# Altium schematic sheet Sheet_TX.SchDoc
size A3
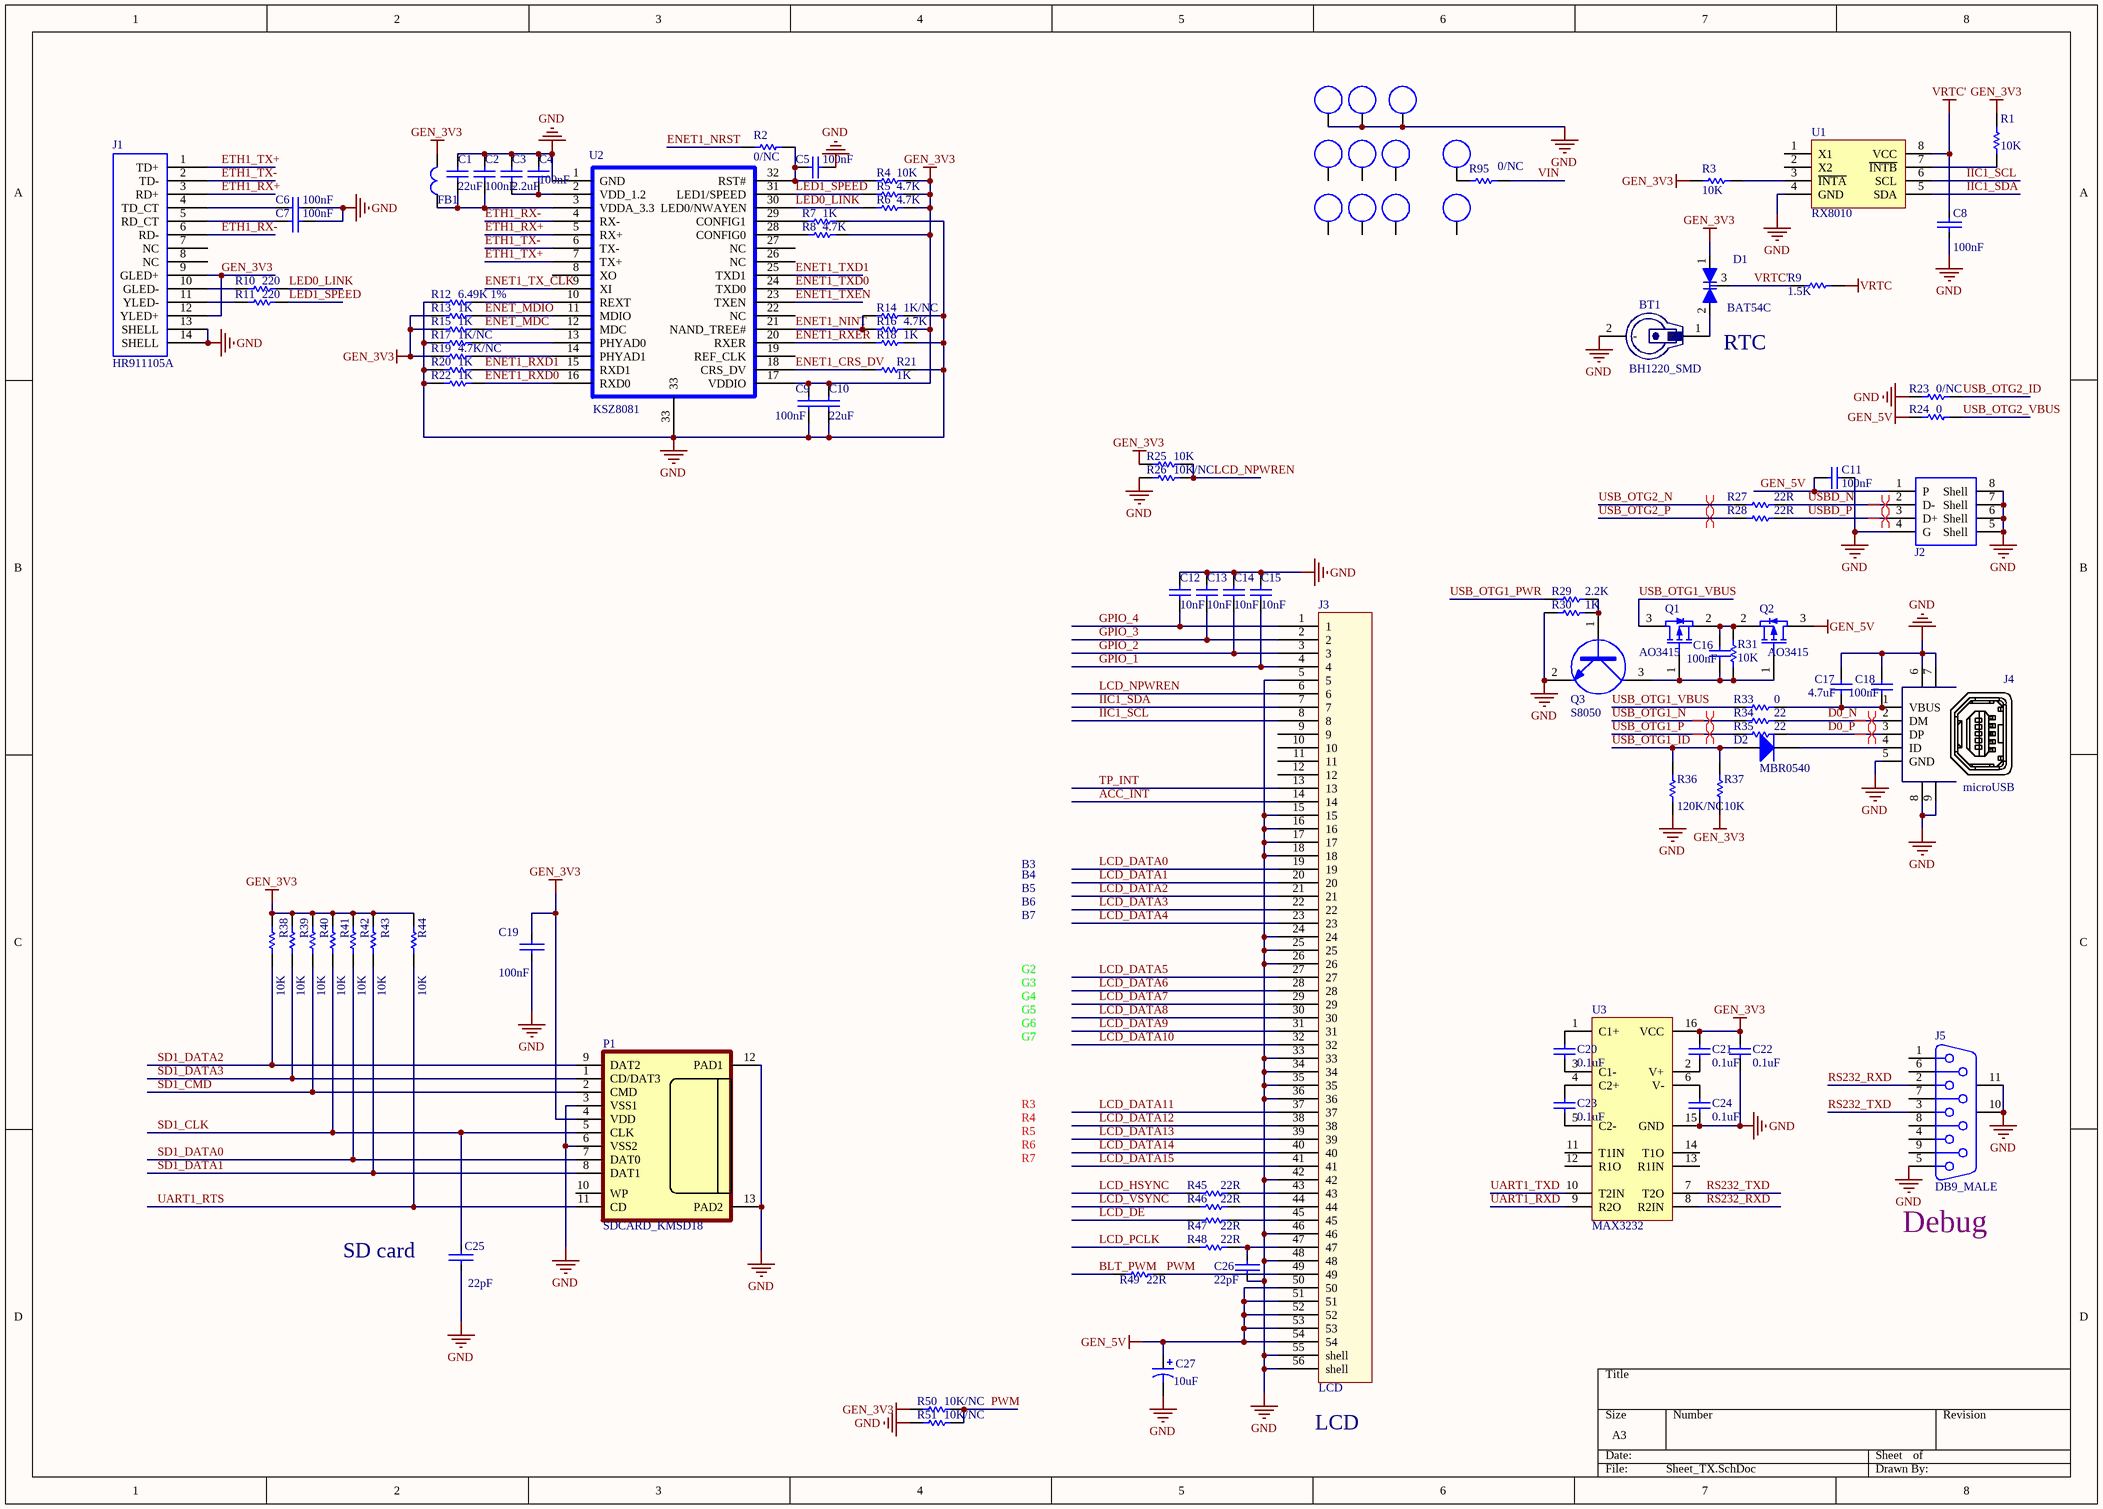
[diagram p0: Sheet_TX.SchDoc]

## Parts
BT1  BH1220_SMD  [B1220]
C1  value 22uF  [0603]  (hidden comment: Cap)
C2  value 100nF  [0603]  (hidden comment: Cap)
C3  value 2.2uF  [0603]  (hidden comment: Cap)
C4  value 100nF  [0603]  (hidden comment: Cap)
C5  value 100nF  [0603]  (hidden comment: Cap)
C6  value 100nF  [0603]  (hidden comment: Cap)
C7  value 100nF  [0603]  (hidden comment: Cap)
C8  100nF  [0603]
C9  value 100nF  [0603]  (hidden comment: Cap)
C10  value 22uF  [0603]  (hidden comment: Cap)
C11  value 100nF  [0603]  (hidden comment: C0603)
C12  value 10nF  [0603]  (hidden comment: C0603)
C13  value 10nF  [0603]  (hidden comment: C0603)
C14  value 10nF  [0603]  (hidden comment: C0603)
C15  value 10nF  [0603]  (hidden comment: C0603)
C16  value 100nF  [0603]  (hidden comment: C0603)
C17  value 4.7uF  [0603]  (hidden comment: C0603)
C18  value 100nF  [0603]  (hidden comment: C0603)
C19  100nF  [0603]
C20  value 0.1uF  [0603]  (hidden comment: C0603)
C21  value 0.1uF  [0603]  (hidden comment: C0603)
C22  value 0.1uF  [0603]  (hidden comment: C0603)
C23  value 0.1uF  [0603]  (hidden comment: C0603)
C24  value 0.1uF  [0603]  (hidden comment: C0603)
C25  22pF  [0603]
C26  22pF  [0603]
C27  value 10uF  [3216A]  (hidden comment: Cap Pol1)
D1  BAT54C  [SOT23]
D2  MBR0540  [SOD-123]
FB1  CZ  [0603]  (value not drawn)
H1  hole  [HOLE]  (value not drawn)
H2  hole  [HOLE]  (value not drawn)
H3  hole  [HOLE]  (value not drawn)
H4  hole  [HOLE]  (value not drawn)
H7  hole  [FLQRS]  (value not drawn)
J1  HR911105A  [RJ-45A12]
J2  USB-A-F-W  [USB-C]  (value not drawn)
J3  LCD  [FPC54_A]
J4  microUSB  [MICRO_USB]
J5  DB9_MALE  [DB9R/M]
M1  hole  [mark]  (value not drawn)
M2  hole  [mark]  (value not drawn)
M3  hole  [mark]  (value not drawn)
M4  hole  [mark]  (value not drawn)
M5  hole  [mark]  (value not drawn)
M6  hole  [mark]  (value not drawn)
P1  SDCARD_KMSD18  [SD-CARD3]
Q1  AO3415  [SOT23]
Q2  AO3415  [SOT23]
Q3  S8050  [SOT23]
R1  10K  [0603]
R2  value 0/NC  [0603]  (hidden comment: Res1)
R3  10K  [0603]
R4  value 10K  [0603]  (hidden comment: Res1)
R5  value 4.7K  [0603]  (hidden comment: Res1)
R6  value 4.7K  [0603]  (hidden comment: Res1)
R7  value 1K  [0603]  (hidden comment: Res1)
R8  value 4.7K  [0603]  (hidden comment: Res1)
R9  value 1.5K  [0603]  (hidden comment: 2.2K)
R10  value 220  [0603]  (hidden comment: Res1)
R11  value 220  [0603]  (hidden comment: Res1)
R12  value 6.49K 1%  [0603]  (hidden comment: Res1)
R13  value 1K  [0603]  (hidden comment: Res1)
R14  value 1K/NC  [0603]  (hidden comment: Res1)
R15  value 1K  [0603]  (hidden comment: Res1)
R16  value 4.7K  [0603]  (hidden comment: Res1)
R17  value 1K/NC  [0603]  (hidden comment: Res1)
R18  value 1K  [0603]  (hidden comment: Res1)
R19  value 4.7K/NC  [0603]  (hidden comment: Res1)
R20  value 1K  [0603]  (hidden comment: Res1)
R21  value 1K  [0603]  (hidden comment: Res1)
R22  value 1K  [0603]  (hidden comment: Res1)
R23  value 0/NC  [0603]  (hidden comment: Res1)
R24  value 0  [0603]  (hidden comment: Res1)
R25  10K  [0603]
R26  value 10K/NC  [0603]  (hidden comment: 10K)
R27  value 22R  [0603]  (hidden comment: 0R)
R28  value 22R  [0603]  (hidden comment: 0R)
R29  value 2.2K  [0603]  (hidden comment: Res1)
R30  value 1K  [0603]  (hidden comment: Res1)
R31  value 10K  [0603]  (hidden comment: Res1)
R33  value 0  [0603]  (hidden comment: Res1)
R34  value 22  [0603]  (hidden comment: 22R)
R35  value 22  [0603]  (hidden comment: 22R)
R36  value 120K/NC  [0603]  (hidden comment: 120K)
R37  10K  [0603]
R38  10K  [0603]
R39  10K  [0603]
R40  10K  [0603]
R41  10K  [0603]
R42  10K  [0603]
R43  10K  [0603]
R44  10K  [0603]
R45  22R  [0603]
R46  22R  [0603]
R47  22R  [0603]
R48  22R  [0603]
R49  22R  [0603]
R50  value 10K/NC  [0603]  (hidden comment: 10K)
R51  value 10K/NC  [0603]  (hidden comment: 10K)
R95  value 0/NC  [0805]  (hidden comment: 10K)
U1  RX8010  [SOIC-8N]
U2  KSZ8081  [QFN-32]
U3  MAX3232  [SO-16]

## Nets
GEN_3V3: C9.1 C10.1 C19.1 C21.1 C22.1 D1.1 FB1.2 J1.9(GLED+) J1.12(YLED+) P1.4(VDD) R1.1 R3.1 R4.1 R5.1 R6.1 R8.1 R13.2 R15.2 R16.1 R19.2 R25.1 R37.1 R38.1 R39.1 R40.1 R41.1 R42.1 R43.1 R44.1 R50.1 U2.17(VDDIO) U3.16(VCC)
GEN_5V: C11.2 C27.1 J2.1(P) J3.50 J3.51 J3.52 J3.53 J3.54 Q2.3(D) R24.1
GND: BT1.2(-) C1.1 C2.1 C3.1 C4.1 C5.1 C6.1 C7.1 C8.2 C9.2 C10.2 C11.1 C12.1 C13.1 C14.1 C15.1 C17.1 C18.1 C19.2 C22.2 C24.2 C25.2 C26.2 C27.2 H1.1 H2.1 H4.1 J1.13(SHELL) J1.14(SHELL) J2.4(G) J2.5(Shell) J2.6(Shell) J2.7(Shell) J2.8(Shell) J3.5 J3.15 J3.16 J3.17 J3.18 J3.24 J3.25 J3.26 J3.33 J3.34 J3.35 J3.36 J3.42 J3.46 J3.48 J3.55(shell) J3.56(shell) J4.5(GND) J4.6 J4.7 J4.8 J4.9 J5.5 J5.10(MH1) J5.11(MH2) P1.3(VSS1) P1.6(VSS2) P1.12(PAD1) P1.13(PAD2) Q3.2(E) R7.1 R12.2 R14.1 R17.2 R18.1 R20.2 R21.1 R22.2 R23.1 R26.1 R30.2 R36.1 R51.1 U1.4(GND) U2.1(GND) U2.33 U3.15(GND)
VRTC: R9.1
VRTC': C8.1 D1.3 R9.2 U1.8(VCC)
ACC_INT: J3.14
BLT_PWM: R49.1
D0_N: J4.2(DM) R34.2
D0_P: J4.3(DP) R35.2
ENET1_CRS_DV: R21.2 U2.18(CRS_DV)
ENET1_NINT: R14.2 R16.2 U2.21(NAND_TREE#)
ENET1_NRST: R2.1
ENET1_RXD0: R22.1 U2.16(RXD0)
ENET1_RXD1: R20.1 U2.15(RXD1)
ENET1_RXER: R18.2 U2.20(RXER)
ENET1_TX_CLK: U2.9(XI)
ENET1_TXD0: U2.24(TXD0)
ENET1_TXD1: U2.25(TXD1)
ENET1_TXEN: U2.23(TXEN)
ENET_MDC: R15.1 U2.12(MDC)
ENET_MDIO: R13.1 U2.11(MDIO)
ETH1_RX+: J1.3(RD+) U2.5(RX+)
ETH1_RX-: J1.6(RD-) U2.4(RX-)
ETH1_TX+: J1.1(TD+) U2.7(TX+)
ETH1_TX-: J1.2(TD-) U2.6(TX-)
GPIO_1: C15.2 J3.4
GPIO_2: C14.2 J3.3
GPIO_3: C13.2 J3.2
GPIO_4: C12.2 J3.1
IIC1_SCL: J3.8 U1.6(SCL)
IIC1_SDA: J3.7 U1.5(SDA)
LCD_DATA0: J3.19
LCD_DATA1: J3.20
LCD_DATA2: J3.21
LCD_DATA3: J3.22
LCD_DATA4: J3.23
LCD_DATA5: J3.27
LCD_DATA6: J3.28
LCD_DATA7: J3.29
LCD_DATA8: J3.30
LCD_DATA9: J3.31
LCD_DATA10: J3.32
LCD_DATA11: J3.37
LCD_DATA12: J3.38
LCD_DATA13: J3.39
LCD_DATA14: J3.40
LCD_DATA15: J3.41
LCD_DE: R47.1
LCD_HSYNC: R45.1
LCD_NPWREN: J3.6 R25.2 R26.2
LCD_PCLK: R48.1
LCD_VSYNC: R46.1
LED0_LINK: R6.2 R10.1 U2.30(LED0/NWAYEN)
LED1_SPEED: R5.2 R11.1 U2.31(LED1/SPEED)
PWM: J3.49 R49.2 R50.2 R51.2
RS232_RXD: J5.2 U3.8(R2IN)
RS232_TXD: J5.3 U3.7(T2O)
SD1_CLK: C25.1 P1.5(CLK) R41.2
SD1_CMD: P1.2(CMD) R40.2
SD1_DATA0: P1.7(DAT0) R42.2
SD1_DATA1: P1.8(DAT1) R43.2
SD1_DATA2: P1.9(DAT2) R38.2
SD1_DATA3: P1.1(CD/DAT3) R39.2
TP_INT: J3.13
UART1_RTS: P1.11(CD) R44.2
UART1_RXD: U3.9(R2O)
UART1_TXD: U3.10(T2IN)
USB_OTG1_ID: D2.1(A) R36.2 R37.2
USB_OTG1_N: R34.1
USB_OTG1_P: R35.1
USB_OTG1_PWR: R29.2
USB_OTG1_VBUS: Q1.3(D) R33.1
USB_OTG2_ID: R23.2
USB_OTG2_N: R27.1
USB_OTG2_P: R28.1
USB_OTG2_VBUS: R24.2
USBD_N: J2.2(D-) R27.2
USBD_P: J2.3(D+) R28.2
VIN: R95.2
NetBT1_1: BT1.1(+) D1.2
NetC1_2: C1.2 C2.2 FB1.1 U2.3(VDDA_3.3)
NetC3_2: C3.2 C4.2 U2.2(VDD_1.2)
NetC5_2: C5.2 R2.2 R4.2 U2.32(RST#)
NetC6_2: C6.2 J1.4(TD_CT)
NetC7_2: C7.2 J1.5(RD_CT)
NetC16_1: C16.1 Q1.2(S) Q2.2(S) R31.2
NetC16_2: C16.2 Q1.1(G) Q2.1(G) Q3.3(C) R31.1
NetC17_2: C17.2 C18.2 J4.1(VBUS) R33.2
NetC20_1: C20.1 U3.1(C1+)
NetC20_2: C20.2 U3.3(C1-)
NetC21_2: C21.2 U3.2(V+)
NetC23_1: C23.1 U3.4(C2+)
NetC23_2: C23.2 U3.5(C2-)
NetC24_1: C24.1 U3.6(V-)
NetC26_1: C26.1 J3.47 R48.2
NetD2_2: D2.2(K) J4.4(ID)
NetH3_1: H3.1 R95.1
NetJ1_10: J1.10(GLED-) R10.2
NetJ1_11: J1.11(YLED-) R11.2
NetJ3_43: J3.43 R45.2
NetJ3_44: J3.44 R46.2
NetJ3_45: J3.45 R47.2
NetQ3_1: Q3.1(B) R29.1 R30.1
NetR1_2: R1.2 U1.7(~{INTB})
NetR3_2: R3.2 U1.3(~{INTA})
NetR7_2: R7.2 U2.29(CONFIG1)
NetR8_2: R8.2 U2.28(CONFIG0)
NetR12_1: R12.1 U2.10(REXT)
NetR17_1: R17.1 U2.13(PHYAD0)
NetR19_1: R19.1 U2.14(PHYAD1)

Not connected (* = marked no-connect by the designer): H7 1; J1 7(NC) 8(NC); J3 9 10 11 12; J5 1 4 6 7 8 9; M1 1; M2 1; M3 1; M4 1; M5 1; M6 1; P1 10(WP); U1 1(X1) 2(X2); U2 8(XO) 19(REF_CLK) 22(NC) 26(NC) 27(NC); U3 11(T1IN) 12(R1O) 13(R1IN) 14(T1O)

## Layout directives
differential pair: D0_N, D0_P, USB_OTG1_N, USB_OTG1_P, USB_OTG2_N, USB_OTG2_P, USBD_N, USBD_P

## Notes on the sheet
- RTC
- B3
- B4
- B5
- B7
- B6
- G2
- G3
- G4
- G5
- G7
- G6
- R3
- R4
- R5
- R7
- R6
- (near C25) SD card
- (near J5) Debug
- (near J3) LCD

## Library data of the parts
BT1 = Battery
C1-C7 C9 C10 C20-C24 = Cap: Capacitor; Published: 8-Jun-2000; LatestRevisionDate: 17-Jul-2002; LatestRevisionNote: Re-released for DXP Platform.; PackageReference: RAD-0.3; Publisher: Altium Limited
  C1-C7 C9 C10: PackageDescription: Radial Cap, Thru-Hole; 2 Leads; 0.3 in Pin Spacing
C8 C19 C25 = CAP_1
  C8 C19: value: 100nF
  C25: value: 22pF
C11-C18 = Cap Semi: Capacitor (Semiconductor SIM Model); Published: 8-Jun-2000; LatestRevisionDate: 29-May-2009; LatestRevisionNote: IPC-7351 Footprint Added.; PackageReference: C1206; Publisher: Altium Limited; PackageDescription: Chip Capacitor
C26 = CAP_1: value: C0603
C27 = Cap Pol1: Polarized Capacitor (Radial); Published: 8-Jun-2000; LatestRevisionDate: 17-Jul-2002; LatestRevisionNote: Re-released for DXP Platform.; PackageReference: RB7.6-15; Publisher: Altium Limited; PackageDescription: Polarized Capacitor (Radial); 2 Leads
D1 = BAT54C: SOT23-3_D
D2 = Diode: Default Diode; Published: 8-Jun-2000; LatestRevisionDate: 17-Jul-2002; LatestRevisionNote: Re-released for DXP Platform.; PackageVersion: Sep-1996; PackageReference: SMC; Publisher: Altium Limited; PackageDescription: DO-214-AB/SMC; 2 C-Bend Leads; Body 7.9 x 5.9 mm, inc. leads (LxW); Code_JEDEC: DO-214-AB
FB1 = CZ: Inductor; Code_IEC: 1005; Published: 8-Jun-2000; LatestRevisionDate: 29-May-2009; LatestRevisionNote: IPC-7351 Footprint Added.; PackageReference: 0402-A; Publisher: Altium Limited; PackageDescription: Chip Inductor; Code_JEITA: 0402
J3 = FPC54
J4 = miniUSB
J5 = D Connector 9: Receptacle Assembly, 9 Position, Right Angle; PackageDocument: O; Positions: 9; Published: 15-Jun-2001; LatestRevisionDate: 17-Jul-2002; LatestRevisionNote: Re-released for DXP Platform.; DatasheetDocument: 1-Sep-1999; PackageReference: 788750; Publisher: Altium Limited; Orientation: Right Angle; Gender: Receptacle
Q1 Q2 = MOSFET-P_1: P-Channel MOSFET; Published: 8-Jun-2000; LatestRevisionDate: 17-Jul-2002; LatestRevisionNote: Re-released for DXP Platform.; PackageVersion: 1995/1996; PackageReference: E3; Publisher: Altium Limited; PackageDescription: TO, Flat Index; 3 In-Line, Axial Leads; Body Dia. 4.6mm; Lead Dia. 0.5 mm (max)
Q3 = NPN: NPN Transistor
R1 R3 R9 R25-R28 R34-R51 R95 = Res1: R0603; Published: 8-Jun-2000; LatestRevisionDate: 17-Jul-2002; LatestRevisionNote: Re-released for DXP Platform.; PackageReference: AXIAL-0.3; Publisher: Altium Limited; PackageDescription: Axial Device, Thru-Hole; 2 Leads; 0.3 in Pin Spacing
  R1 R3 R25 R37-R44: Value: 10K
  R45-R49: Value: R0603
R2 R4-R8 R10-R24 R29-R31 R33 = Res1: Resistor; Published: 8-Jun-2000; LatestRevisionDate: 17-Jul-2002; LatestRevisionNote: Re-released for DXP Platform.; PackageReference: AXIAL-0.3; Publisher: Altium Limited; PackageDescription: Axial Device, Thru-Hole; 2 Leads; 0.3 in Pin Spacing
U1 = DS1337
U2 = KSZ8081RNB
U3 = MAX202E: TI SOIC16